# EAGLE design driver (EAGLE 9.6.2)
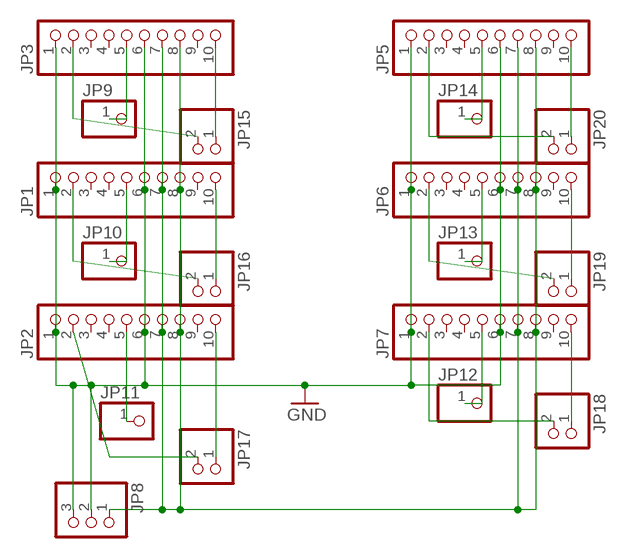
[diagram p0: schematic, sheet 1]

## Parts
JP1  PINHD-1X10  [1X10]
JP2  PINHD-1X10  [1X10]
JP3  PINHD-1X10  [1X10]
JP5  PINHD-1X10  [1X10]
JP6  PINHD-1X10  [1X10]
JP7  PINHD-1X10  [1X10]
JP8  PINHD-1X3  [1X03]
JP9  PINHD-1X1  [1X01]
JP10  PINHD-1X1  [1X01]
JP11  PINHD-1X1  [1X01]
JP12  PINHD-1X1  [1X01]
JP13  PINHD-1X1  [1X01]
JP14  PINHD-1X1  [1X01]
JP15  PINHD-1X2  [1X02]
JP16  PINHD-1X2  [1X02]
JP17  PINHD-1X2  [1X02]
JP18  PINHD-1X2  [1X02]
JP19  PINHD-1X2  [1X02]
JP20  PINHD-1X2  [1X02]

## Nets
GND: JP1.1 JP1.6 JP2.1 JP2.6 JP3.1 JP3.6 JP5.1 JP5.6 JP6.1 JP6.6 JP7.1 JP7.6 JP8.2 JP8.3
N$1: JP2.5 JP11.1
N$2: JP3.5 JP9.1
N$3: JP3.2 JP15.2
N$4: JP3.10 JP15.1
N$5: JP5.2 JP20.2
N$6: JP1.5 JP10.1
N$7: JP2.2 JP17.2
N$8: JP2.10 JP17.1
N$11: JP7.5 JP12.1
N$12: JP6.5 JP13.1
N$13: JP5.5 JP14.1
N$14: JP1.10 JP16.1
N$15: JP1.7 JP1.8 JP2.7 JP2.8 JP3.7 JP3.8 JP5.7 JP5.8 JP6.7 JP6.8 JP7.7 JP7.8 JP8.1
N$16: JP1.2 JP16.2
N$17: JP5.10 JP20.1
N$18: JP6.10 JP19.1
N$19: JP7.10 JP18.1
N$20: JP7.2 JP18.2
N$21: JP6.2 JP19.2
Unconnected: JP1.3 JP1.4 JP1.9 JP2.3 JP2.4 JP2.9 JP3.3 JP3.4 JP3.9 JP5.3 JP5.4 JP5.9 JP6.3 JP6.4 JP6.9 JP7.3 JP7.4 JP7.9

## Library data of the parts
JP1-JP3 JP5-JP7 = pinhead:PINHD-1X10: PIN HEADER
JP8 = pinhead:PINHD-1X3: PIN HEADER
JP9-JP14 = pinhead:PINHD-1X1: PIN HEADER
JP15-JP20 = pinhead:PINHD-1X2: PIN HEADER

## Board
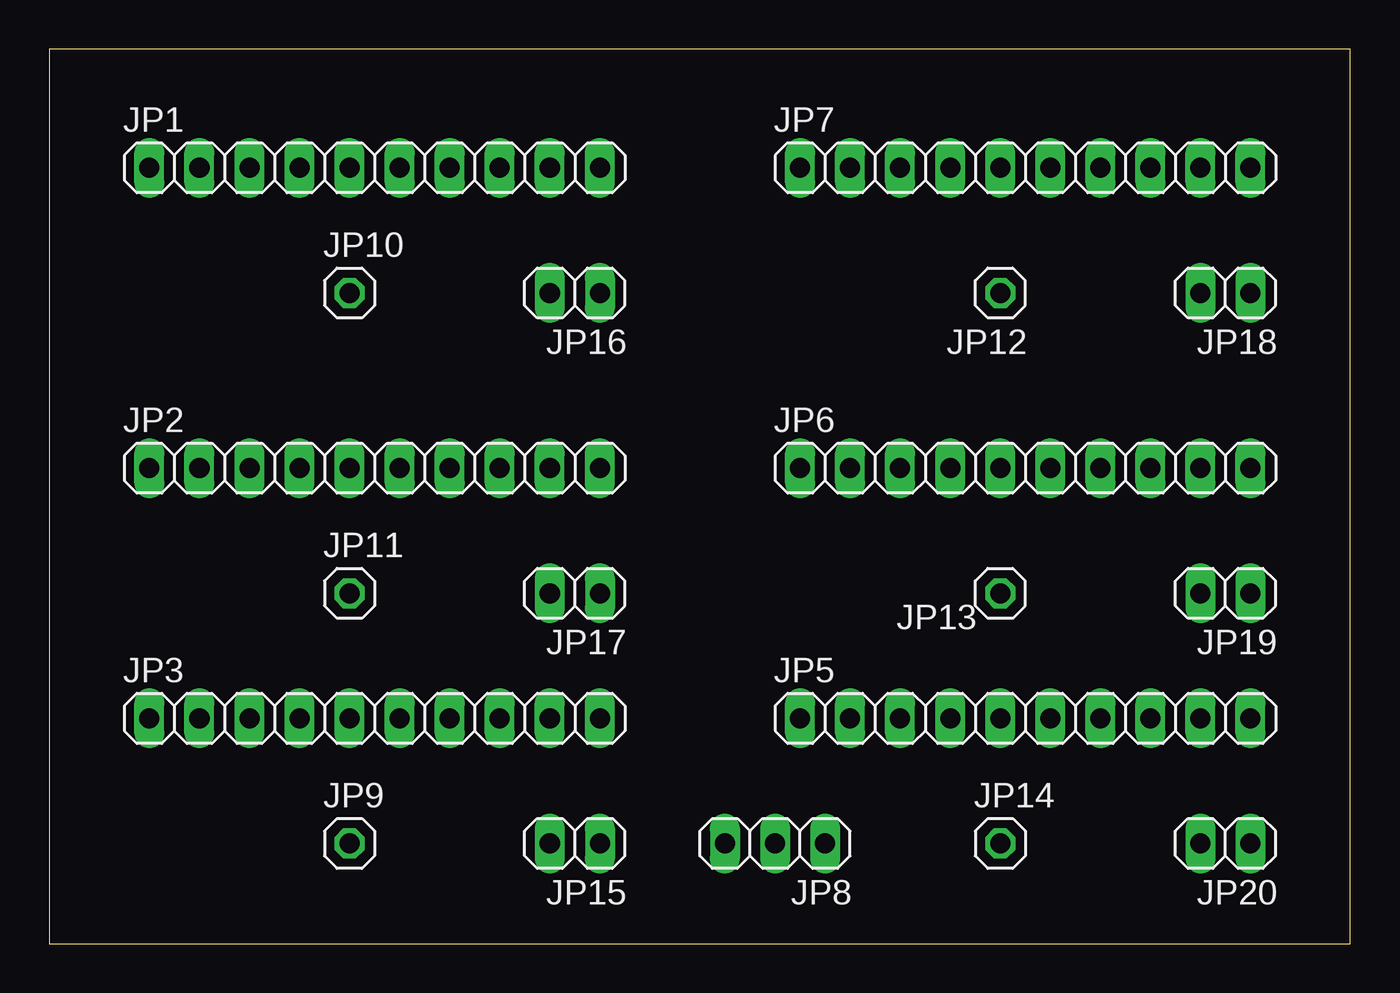
[diagram p1: board, top side]
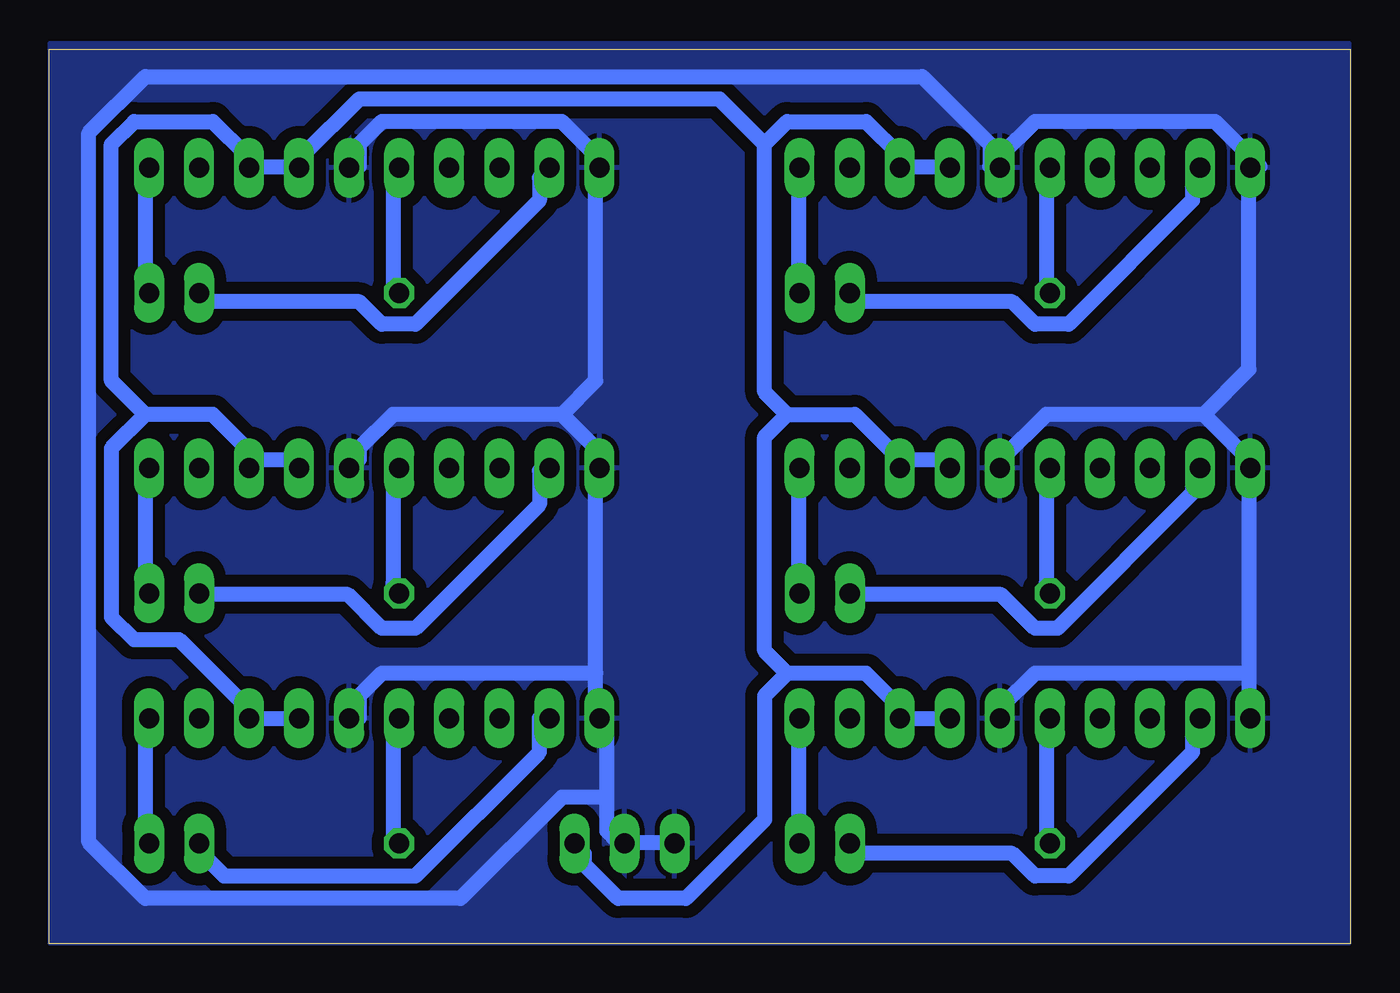
[diagram p2: board, bottom side, seen from below]

Size 66.02 x 45.39 mm. Coordinates in mm from the lower left corner, seen from the top.
Outline: 0,0 66.02,0 66.02,45.39 0,45.39 0,0
Copper layers (1*16): Top 0.035mm / dielectric 1.5mm / Bottom 0.035mm
Design rules "default *": minimum track width 6mil, minimum drill 0.35mm, track to track 24mil, track to pad 24mil, pad to pad 24mil, via to via 24mil, smd to smd 6mil, copper to edge 0mil, drill to drill 6mil, minimum pad ring 10mil, minimum via ring 8mil, stop-mask expansion 4mil, vias tented up to drill 0mil, thermal gap 10mil

### Footprints (pad centres in the part's own frame; a part is rotated, then mirrored left to right if it is on the bottom)
1X10 = drill 1.016 long: 1 -11.43,0; 2 -8.89,0; 3 -6.35,0; 4 -3.81,0; 5 -1.27,0; 6 1.27,0; 7 3.81,0; 8 6.35,0; 9 8.89,0; 10 11.43,0
1X03 = drill 1.016 long: 1 -2.54,0; 2 0,0; 3 2.54,0
1X01 = drill 1.016 octagon: 1 0,0
1X02 = drill 1.016 long: 1 -1.27,0; 2 1.27,0

### Placement (x,y rotation side)
JP1  16.51,39.37 0 top
JP2  16.51,24.13 0 top
JP3  16.51,11.43 0 top
JP5  49.53,11.43 0 top
JP6  49.53,24.13 0 top
JP7  49.53,39.37 0 top
JP8  36.83,5.08 180 top
JP9  15.24,5.08 0 top
JP10  15.24,33.02 0 top
JP11  15.24,17.78 0 top
JP12  48.26,33.02 180 top
JP13  48.26,17.78 180 top
JP14  48.26,5.08 0 top
JP15  26.67,5.08 180 top
JP16  26.67,33.02 180 top
JP17  26.67,17.78 180 top
JP18  59.69,33.02 180 top
JP19  59.69,17.78 180 top
JP20  59.69,5.08 180 top

### Tracks (layer width: path | path; a pad name or v marks a point on that pad's centre or on a via)
GND
  Bottom 0.762: 5.14,13.72 5.14,24 JP2.1 5.14,24.57 7.43,26.86 | 5.14,13.72 5.14,11.43 JP3.1 | 5.14,13.72 16,13.72 17.72,12 17.72,11.43 JP3.6 | 7.43,26.86 15.43,26.86 17.72,24.57 JP2.6 | 7.43,26.86 5.14,29.15 5.14,38.86 JP1.1 4.57,39.43 6.86,41.72 16,41.72 17.72,40.01 17.72,39.43 JP1.6 18.29,39.43 18.29,40.58 21.72,44.01 61.15,44.01 64.01,41.15 64.01,5.14 61.15,2.29 45.15,2.29 40.01,7.43 37.72,7.43 | JP8.3 34.29,5.14 36.58,5.14 JP8.2 37.15,5.14 37.72,5.71 37.72,7.43 | 37.72,7.43 37.72,11.43 JP5.1 38.29,11.43 38.29,13.72 | 38.29,13.72 38.29,24 JP6.1 37.72,24.57 40.01,26.86 | 38.29,13.72 49.15,13.72 50.29,12.57 50.29,11.43 JP5.6 | 40.01,26.86 48.58,26.86 50.29,25.15 50.29,24.57 JP6.6 | 40.01,26.86 38.29,28.57 38.29,38.86 JP7.1 37.72,39.43 40.01,41.72 49.15,41.72 50.29,40.58 50.29,39.43 JP7.6
  pour Bottom: 0,45.72 66.04,45.72 66.04,0 0,0
N$1
  Bottom 0.762: JP11.1 15.43,18.29 15.43,24 JP2.5
N$2
  Bottom 0.762: JP9.1 15.43,5.14 15.43,11.43 JP3.5
N$3
  Bottom 0.762: JP15.2 25.15,4.57 17.14,4.57 16,3.43 14.29,3.43 8,9.72 8,11.43 JP3.2
N$4
  Bottom 0.762: JP15.1 28,5.14 28,11.43 JP3.10
N$5
  Bottom 0.762: JP5.2 41.15,11.43 41.15,9.72 47.43,3.43 57.15,3.43 58.29,4.57 JP20.2
N$6
  Bottom 0.762: JP10.1 15.43,33.15 15.43,38.86 JP1.5
N$7
  Bottom 0.762: JP17.2 25.15,17.72 17.72,17.72 16,16 14.86,16 8,22.86 8,24 JP2.2
N$8
  Bottom 0.762: JP17.1 28,18.29 28,24 JP2.10
N$11
  Bottom 0.762: JP12.1 48.58,33.15 48.58,38.86 JP7.5
N$12
  Bottom 0.762: JP13.1 48.58,18.29 48.58,24 JP6.5
N$13
  Bottom 0.762: JP14.1 48.58,5.14 48.58,11.43 JP5.5
N$14
  Bottom 0.762: JP16.1 28,33.15 28,38.86 JP1.10
N$15
  Bottom 0.762: JP5.7 JP5.8 56.01,11.43 56.01,12 59.44,15.43 61.72,15.43 62.87,16.57 62.87,25.15 61.15,26.86 | 55.44,24.57 53.72,24.57 JP6.7 | 61.15,26.86 57.72,26.86 55.44,24.57 | 55.44,24.57 JP6.8 | 61.15,26.86 62.87,28.57 62.87,40.58 61.72,41.72 57.72,41.72 56.01,40.01 56.01,39.43 JP7.8 55.44,39.43 53.72,39.43 JP7.7 53.15,39.43 53.15,40.01 50.29,42.86 32,42.86 29.72,40.58 | 22.86,39.43 20.57,39.43 JP1.7 | 22.86,24.57 20.57,24.57 JP2.7 | 22.29,11.43 JP3.7 | 28.57,13.72 29.72,12.57 29.72,6.29 33.72,2.29 37.15,2.29 38.86,4 38.86,4.57 JP8.1 | 28.57,13.72 24.57,13.72 22.29,11.43 | 22.29,11.43 JP3.8 | 22.86,24.57 25.15,26.86 28.57,26.86 | 28.57,26.86 29.72,25.72 29.72,14.86 28.57,13.72 | 22.86,24.57 JP2.8 | 22.86,39.43 22.86,40.01 24.57,41.72 28.57,41.72 29.72,40.58 | 29.72,40.58 29.72,28 28.57,26.86 | 22.86,39.43 JP1.8
N$16
  Bottom 0.762: JP16.2 25.15,32.58 17.14,32.58 16,31.43 14.29,31.43 8,37.72 8,38.86 JP1.2
N$17
  Bottom 0.762: JP20.1 61.15,5.14 61.15,11.43 JP5.10
N$18
  Bottom 0.762: JP19.1 61.15,18.29 61.15,24 JP6.10
N$19
  Bottom 0.762: JP18.1 61.15,33.15 61.15,38.86 JP7.10
N$20
  Bottom 0.762: JP18.2 58.29,32.58 50.29,32.58 49.15,31.43 47.43,31.43 41.15,37.72 41.15,38.86 JP7.2
N$21
  Bottom 0.762: JP19.2 58.29,17.72 50.86,17.72 49.15,16 47.43,16 41.15,22.29 41.15,24 JP6.2